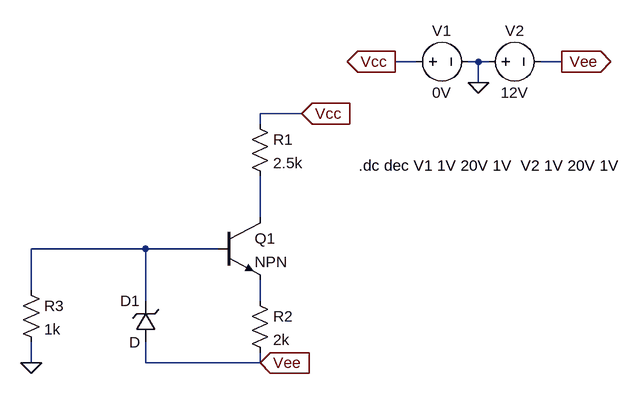
[diagram p0: schematic constant_current_using_zener_diode.asc]
constant_current_using_zener_diode.asc, the LTspice schematic file:
Version 4.1
SHEET 1 888 680
WIRE 448 -160 416 -160
WIRE 544 -160 528 -160
WIRE 560 -160 544 -160
WIRE 672 -160 640 -160
WIRE 544 -128 544 -160
WIRE 272 -80 208 -80
WIRE 208 -64 208 -80
WIRE 208 80 208 16
WIRE 32 128 -144 128
WIRE 144 128 32 128
WIRE -144 192 -144 128
WIRE 32 208 32 128
WIRE 208 208 208 176
WIRE -144 304 -144 272
WIRE 32 304 32 272
WIRE 208 304 208 288
WIRE 208 304 32 304
FLAG 544 -128 0
FLAG 416 -160 Vcc
IOPIN 416 -160 Out
FLAG 672 -160 Vee
IOPIN 672 -160 Out
FLAG 272 -80 Vcc
IOPIN 272 -80 In
FLAG 208 304 Vee
IOPIN 208 304 In
FLAG -144 304 0
SYMBOL npn 144 80 R0
SYMATTR InstName Q1
SYMBOL zener 48 272 R180
WINDOW 0 24 64 Left 2
WINDOW 3 24 0 Left 2
SYMATTR InstName D1
SYMBOL res 192 -80 R0
SYMATTR InstName R1
SYMATTR Value 2.5k
SYMBOL res 192 192 R0
SYMATTR InstName R2
SYMATTR Value 2k
SYMBOL voltage 432 -160 R270
WINDOW 0 32 56 VTop 2
WINDOW 3 -32 56 VBottom 2
WINDOW 123 0 0 Left 0
WINDOW 39 0 0 Left 0
SYMATTR InstName V1
SYMATTR Value 0V
SYMBOL voltage 544 -160 R270
WINDOW 0 32 56 VTop 2
WINDOW 3 -32 56 VBottom 2
WINDOW 123 0 0 Left 0
WINDOW 39 0 0 Left 0
SYMATTR InstName V2
SYMATTR Value 12V
SYMBOL res -160 176 R0
SYMATTR InstName R3
SYMATTR Value 1k
TEXT 360 0 Left 2 !.dc dec V1 1V 20V 1V  V2 1V 20V 1V

The netlist it stands for:
* constant_current_using_zener_diode.asc
Q1 N001 N002 N003 0 NPN
D1 Vee N002 D
R1 Vcc N001 2.5k
R2 N003 Vee 2k
V1 Vcc 0 0V
V2 0 Vee 12V
R3 N002 0 1k
.model D D
.lib standard.dio
.model NPN NPN
.model PNP PNP
.lib standard.bjt
.dc dec V1 1V 20V 1V  V2 1V 20V 1V
.backanno
.end